# EAGLE design dabpi_v11 (EAGLE 6.6.0)
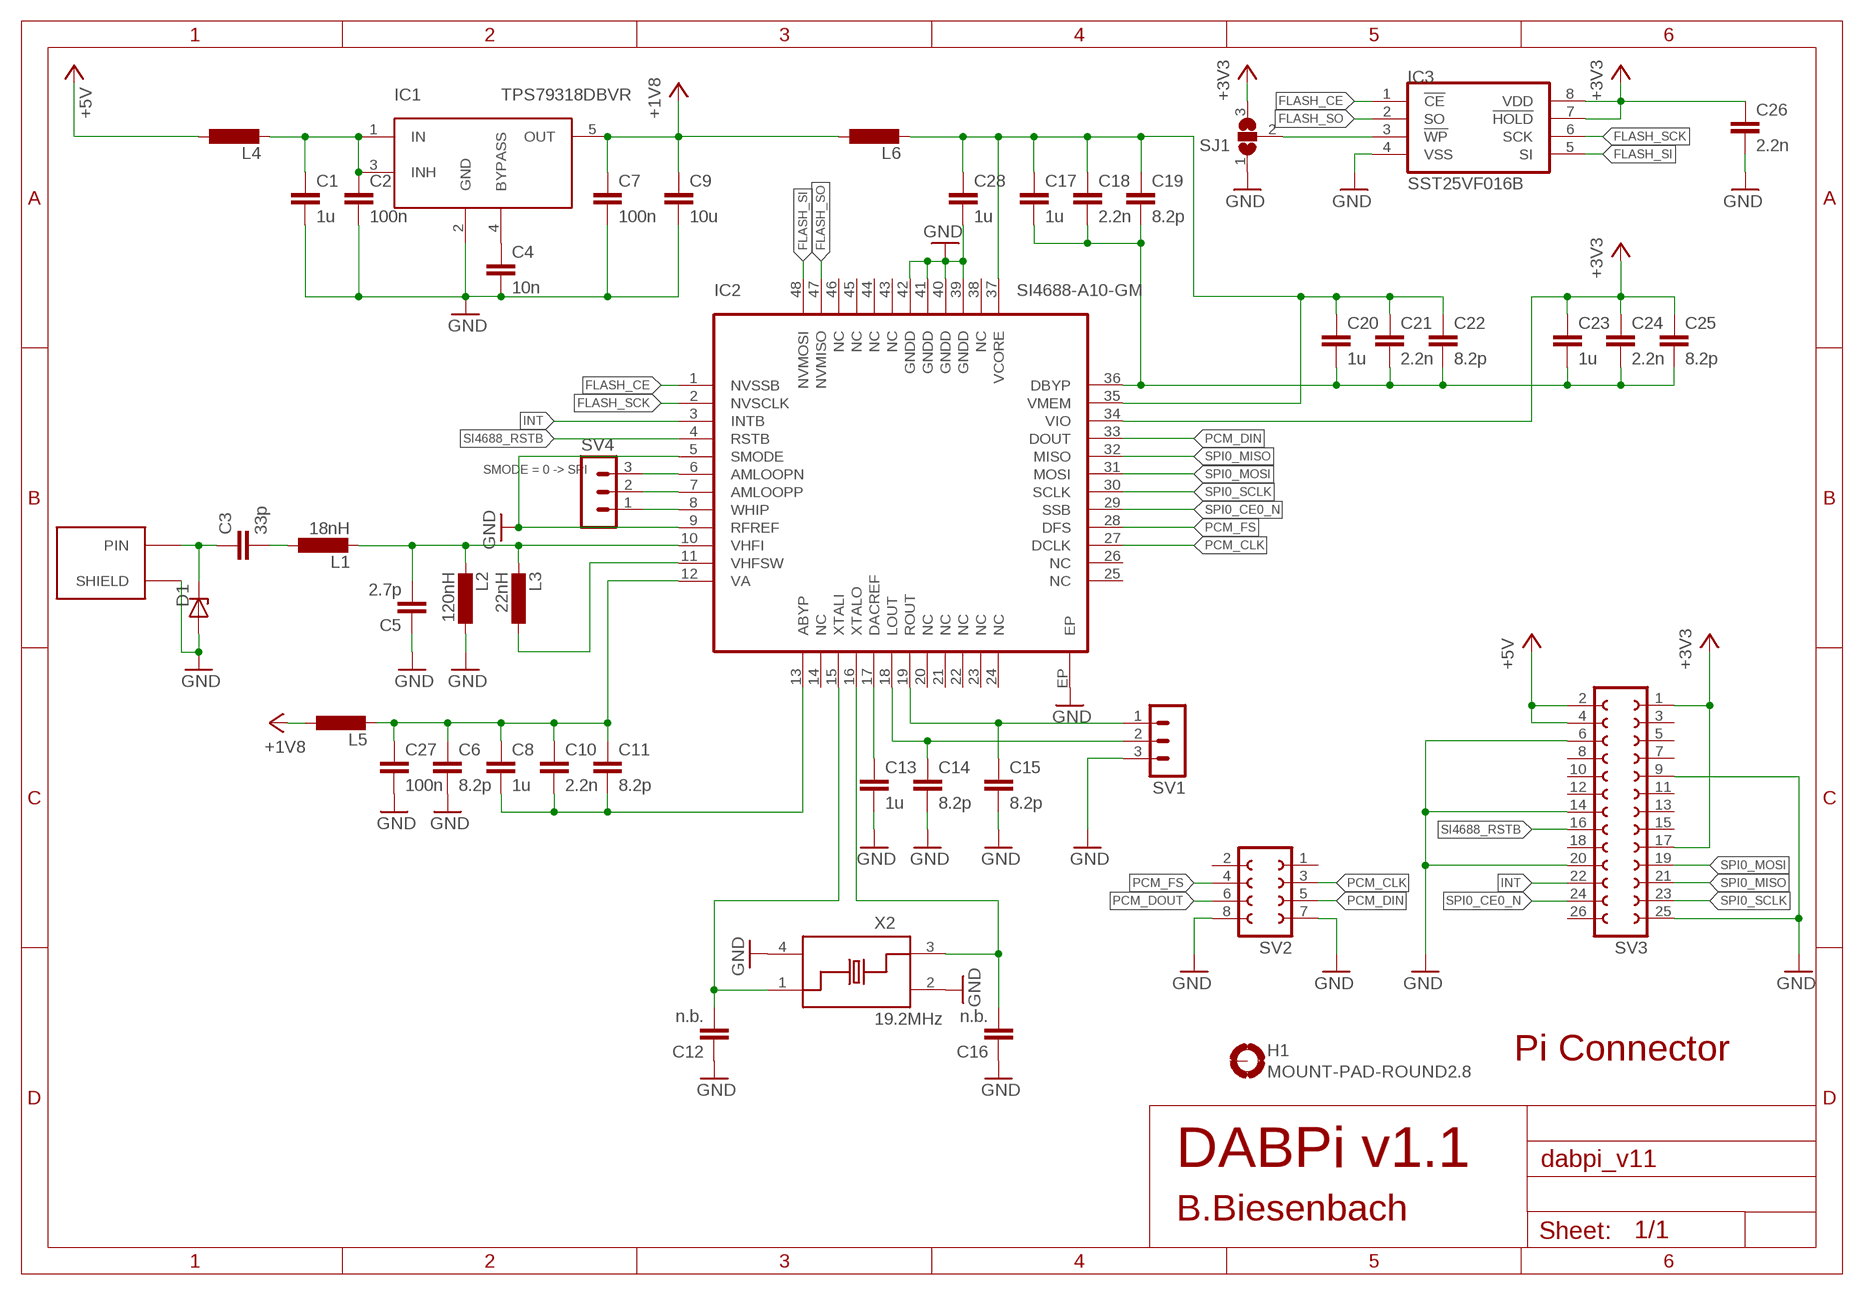
[diagram p0: schematic, sheet 1]

## Parts
C1  1u  C0603  [SMD0603]
C2  100n  C0603  [SMD0603]
C3  33p  C0402  [SMD0402]
C4  10n  C0603  [SMD0603]
C5  2.7p  C0402  [SMD0402]
C6  8.2p  C0603  [SMD0603]
C7  100n  C0603  [SMD0603]
C8  1u  C0603  [SMD0603]
C9  10u  C0603  [SMD0603]
C10  2.2n  C0603  [SMD0603]
C11  8.2p  C0603  [SMD0603]
C12  n.b.  C0402  [SMD0402]
C13  1u  C0603  [SMD0603]
C14  8.2p  C0603  [SMD0603]
C15  8.2p  C0603  [SMD0603]
C16  n.b.  C0402  [SMD0402]
C17  1u  C0603  [SMD0603]
C18  2.2n  C0603  [SMD0603]
C19  8.2p  C0603  [SMD0603]
C20  1u  C0603  [SMD0603]
C21  2.2n  C0603  [SMD0603]
C22  8.2p  C0603  [SMD0603]
C23  1u  C0603  [SMD0603]
C24  2.2n  C0603  [SMD0603]
C25  8.2p  C0603  [SMD0603]
C26  2.2n  C0603  [SMD0603]
C27  100n  C0603  [SMD0603]
C28  1u  C0603  [SMD0603]
D1  ESD9L5.0  [SOD923]
H1  MOUNT-PAD-ROUND2.8  [2,8-PAD]
IC1  TPS79318DBVR  [SOT23-5]
IC2  SI4688-A10-GM  [QFN48]
IC3  SST25VF016B  [SO08]
L1  18nH  L0402  [SMD0402]
L2  120nH  L0402  [SMD0402]
L3  22nH  L0402  [SMD0402]
L4  L0603  [SMD0603]
L5  L0603  [SMD0603]
L6  L0603  [SMD0603]
SJ1  SJ2W  [SJ_2]
SV1  MA03-1  [MA03-1]
SV2  FE04-2  [FE04-2]
SV3  FE13-2  [FE13-2]
SV4  MA03-1  [MA03-1]
X1  SMA_LP_1.57MM  [SMA_LP_1.57MM]
X2  19.2MHz  XTAL_3.2X2.5  [XTAL_3.2X2.5]

## Nets
+1V8: C7.1 C9.1 IC1.5(OUT) L5.1 L6.1
+3V3: C23.1 C24.1 C25.1 C26.1 IC2.34(VIO) IC3.7(!HOLD) IC3.8(VDD) SJ1.3 SV3.1 SV3.17
+5V: L4.1 SV3.2 SV3.4
FLASH_CE: IC2.1(NVSSB) IC3.1(!CE)
FLASH_SCK: IC2.2(NVSCLK) IC3.6(SCK)
FLASH_SI: IC2.48(NVMOSI) IC3.5(SI)
FLASH_SO: IC2.47(NVMISO) IC3.2(SO)
GND: C1.2 C2.2 C4.2 C5.1 C6.2 C7.2 C9.2 C12.1 C13.2 C14.2 C15.2 C16.1 C26.2 C27.2 C28.2 D1.A IC1.2(GND) IC2.5(SMODE) IC2.9(RFREF) IC2.39(GNDD) IC2.40(GNDD) IC2.41(GNDD) IC2.42(GNDD) IC2.EP IC3.4(VSS) L2.1 SJ1.1 SV1.3 SV2.7 SV2.8 SV3.6 SV3.9 SV3.14 SV3.20 SV3.25 X1.GND(SHIELD) X1.GND@1(SHIELD) X1.GND@2(SHIELD) X1.GND@3(SHIELD) X2.2(GND) X2.4(GND)
INT: IC2.3(INTB) SV3.22
LDO_IN: C1.1 C2.1 IC1.1(IN) IC1.3(INH) L4.2
N$1: C3.2 L1.1
N$2: C5.2 IC2.10(VHFI) L1.2 L2.2 L3.2
N$3: IC2.11(VHFSW) L3.1
N$4: C8.2 C10.2 C11.2 IC2.13(ABYP)
N$5: C17.2 C18.2 C19.2 C20.2 C21.2 C22.2 C23.2 C24.2 C25.2 IC2.36(DBYP)
N$6: C12.2 IC2.15(XTALI) X2.1
N$7: C16.2 IC2.16(XTALO) X2.3
N$8: C13.1 IC2.17(DACREF)
N$9: IC3.3(!WP) SJ1.2
N$11: C4.1 IC1.4(BYPASS)
N$12: C6.1 C8.1 C10.1 C11.1 C27.1 IC2.12(VA) L5.2
N$13: IC2.6(AMLOOPN) SV4.3
N$14: C17.1 C18.1 C19.1 C20.1 C21.1 C22.1 C28.1 IC2.35(VMEM) IC2.37(VCORE) L6.2
N$15: IC2.7(AMLOOPP) SV4.2
N$16: IC2.8(WHIP) SV4.1
PCM_CLK: IC2.27(DCLK) SV2.3
PCM_DIN: IC2.33(DOUT) SV2.5
PCM_DOUT: SV2.6
PCM_FS: IC2.28(DFS) SV2.4
RF_IN: C3.1 D1.K(C) X1.PIN
SI4688_LOUT: C14.1 IC2.18(LOUT) SV1.2
SI4688_ROUT: C15.1 IC2.19(ROUT) SV1.1
SI4688_RSTB: IC2.4(RSTB) SV3.16
SPI0_CE0_N: IC2.29(SSB) SV3.24
SPI0_MISO: IC2.32(MISO) SV3.21
SPI0_MOSI: IC2.31(MOSI) SV3.19
SPI0_SCLK: IC2.30(SCLK) SV3.23
Unconnected: H1.B2,8(MOUNT) IC2.14(NC) IC2.20(NC) IC2.21(NC) IC2.22(NC) IC2.23(NC) IC2.24(NC) IC2.25(NC) IC2.26(NC) IC2.38(NC) IC2.43(NC) IC2.44(NC) IC2.45(NC) IC2.46(NC) SV2.1 SV2.2 SV3.3 SV3.5 SV3.7 SV3.8 SV3.10 SV3.11 SV3.12 SV3.13 SV3.15 SV3.18 SV3.26

## Notes on the sheet
- SMODE = 0 -> SPI
- Pi Connector
- DABPi v1.1
- B.Biesenbach

## Library data of the parts
C1 C2 C4 C6-C11 C13-C15 C17-C28 = generisch:C0603
C3 C5 C12 C16 = generisch:C0402
D1 = generisch:ESD9L5.0
H1 = holes:MOUNT-PAD-ROUND: MOUNTING PAD, round
IC1 = ldo_reg:TPS79318DBVR
IC2 = SI4688-A10-GM:SI4688-A10-GM
IC3 = sst25:SST25VF016B
L1-L3 = generisch:L0402
L4-L6 = generisch:L0603
SJ1 = jumper:SJ2W: SMD solder JUMPER
SV1 SV4 = con-lstb:MA03-1: PIN HEADER; OC_FARNELL: unknown; OC_NEWARK: unknown
SV2 = generisch:FE04-2: FEMALE HEADER; OC_FARNELL: unknown; OC_NEWARK: unknown
SV3 = con-lsta:FE13-2: FEMALE HEADER; OC_FARNELL: unknown; OC_NEWARK: unknown
X1 = con_sma:SMA_LP_1.57MM: Abschlussbuchse SMA LP rund 1,57mm RS 526-5785
X2 = generisch:XTAL_3.2X2.5

## Board
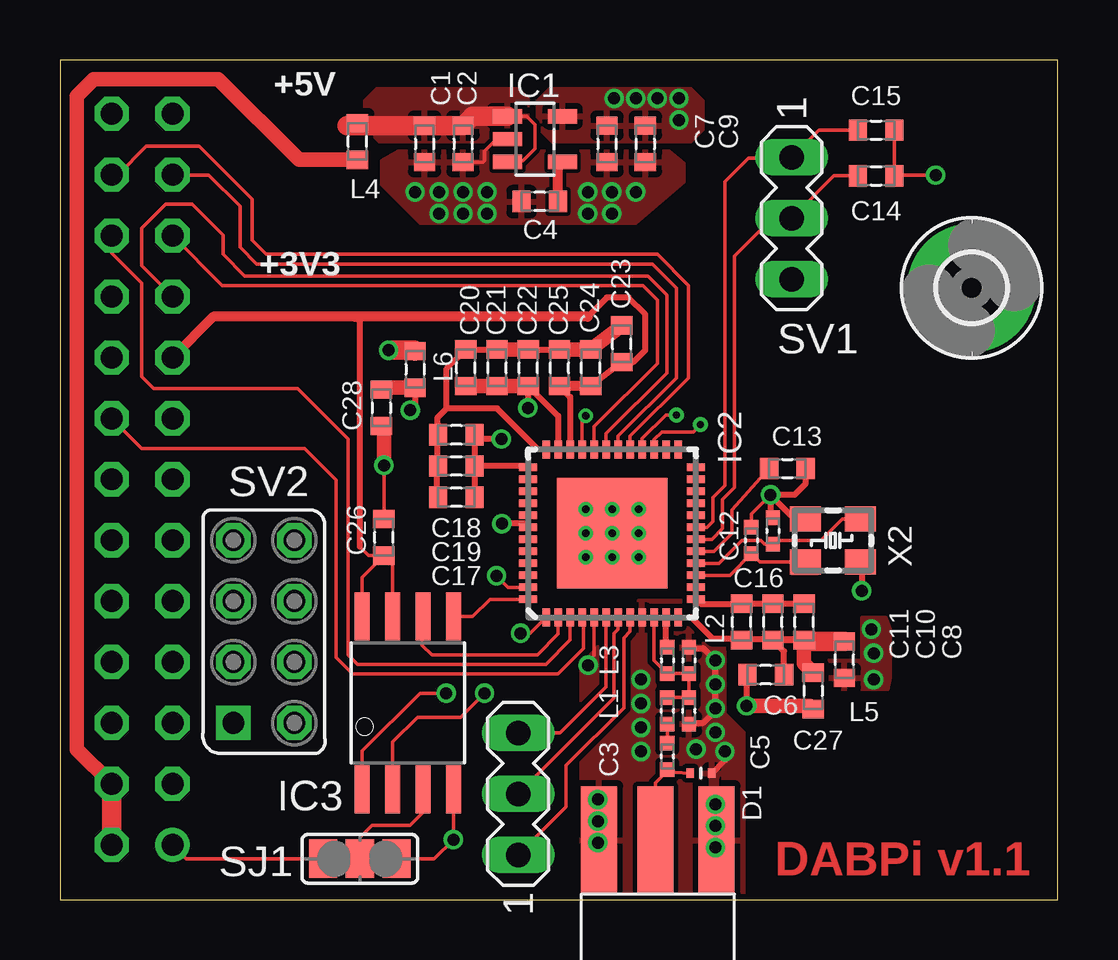
[diagram p1: board, top side]
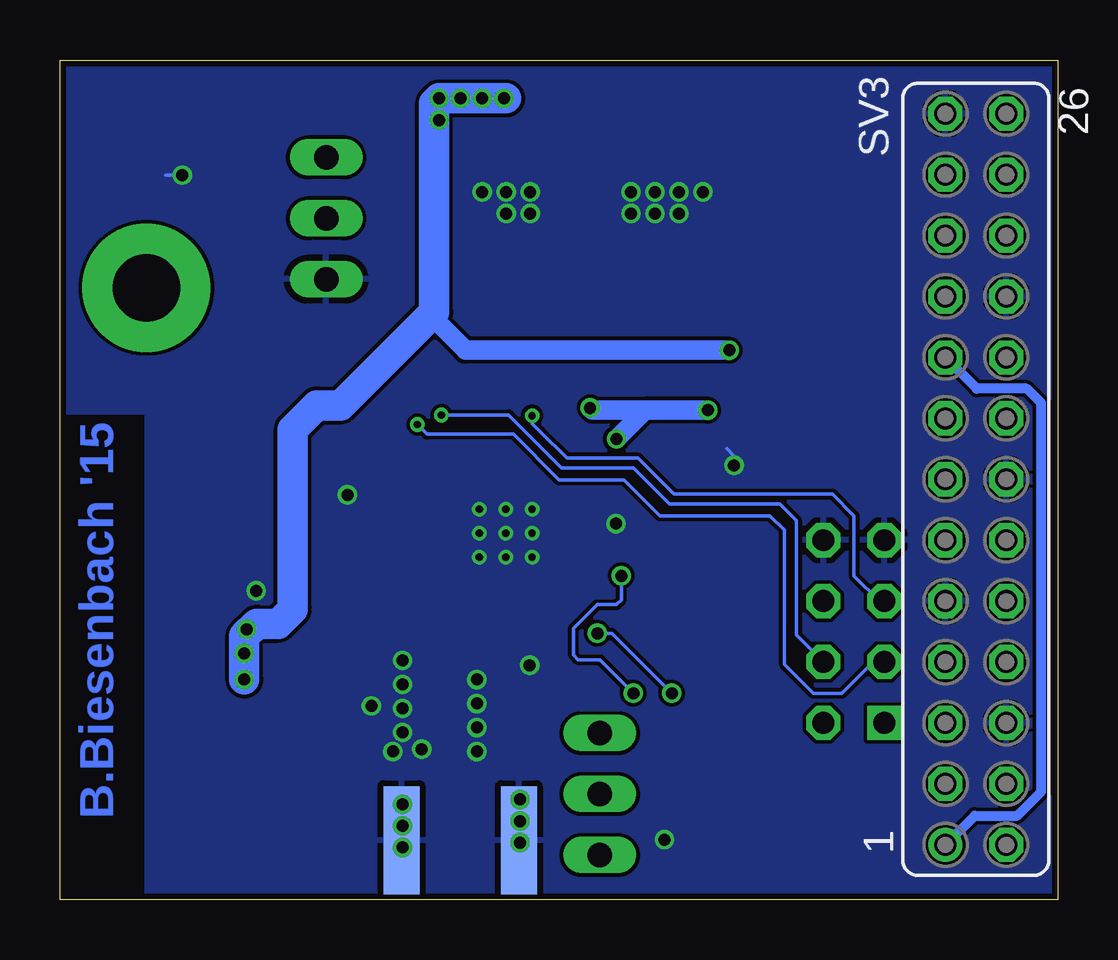
[diagram p2: board, bottom side, seen from below]

Size 41.6 x 35 mm. Coordinates in mm from the lower left corner, seen from the top.
Outline: 0,0 41.6,0 41.6,35 0,35 0,0
Copper layers (1*16): Top 0.035mm / dielectric 1.5mm / Bottom 0.035mm
Design rules "Elecrow_2-layer_eagle_rule *": minimum track width 6mil, minimum drill 12mil, track to track 6mil, track to pad 6mil, pad to pad 6mil, via to via 6mil, smd to smd 0mil, copper to edge 10mil, drill to drill 10mil, minimum pad ring 10mil, minimum via ring 6mil, stop-mask expansion 2mil, vias tented up to drill 0mil, thermal gap 10mil
tKeepout: area 29.1,0 to 41.6,3.1
bRestrict: area 38.1,0 to 41.6,20.2

### Footprints (pad centres in the part's own frame; a part is rotated, then mirrored left to right if it is on the bottom)
SMD0603 = smd 0.762 x 0.889: 1 -0.762,0; 2 0.762,0
SMD0402 = smd 0.6 x 0.6: 1 -0.55,0; 2 0.55,0
SOD923 = smd 0.3 x 0.4: A -0.45,0; K 0.45,0
2,8-PAD = drill 2.8 pad 5.334: B2,8 0,0
SOT23-5 = smd 0.6 x 1.2: 1 -0.95,-1.15; 2 0,-1.15; 3 0.95,-1.15; 4 0.95,1.15; 5 -0.95,1.15
QFN48 = smd 0.75 x 0.3: 1 -3.5,2.75; 2 -3.5,2.25; 3 -3.5,1.75; 4 -3.5,1.25; 5 -3.5,0.75; 6 -3.5,0.25; 7 -3.5,-0.25; 8 -3.5,-0.75; 9 -3.5,-1.25; 10 -3.5,-1.75; 11 -3.5,-2.25; 12 -3.5,-2.75; 25 3.5,-2.75; 26 3.5,-2.25; 27 3.5,-1.75; 28 3.5,-1.25; 29 3.5,-0.75; 30 3.5,-0.25; 31 3.5,0.25; 32 3.5,0.75; 33 3.5,1.25; 34 3.5,1.75; 35 3.5,2.25; 36 3.5,2.75 | smd 0.3 x 0.75: 13 -2.75,-3.5; 14 -2.25,-3.5; 15 -1.75,-3.5; 16 -1.25,-3.5; 17 -0.75,-3.5; 18 -0.25,-3.5; 19 0.25,-3.5; 20 0.75,-3.5; 21 1.25,-3.5; 22 1.75,-3.5; 23 2.25,-3.5; 24 2.75,-3.5; 37 2.75,3.5; 38 2.25,3.5; 39 1.75,3.5; 40 1.25,3.5; 41 0.75,3.5; 42 0.25,3.5; 43 -0.25,3.5; 44 -0.75,3.5; 45 -1.25,3.5; 46 -1.75,3.5; 47 -2.25,3.5; 48 -2.75,3.5 | smd 4.6 x 4.6: EP 0,0
SO08 = smd 0.61 x 2: 1 -1.905,-3.6; 2 -0.635,-3.6; 3 0.635,-3.6; 4 1.905,-3.6; 5 1.905,3.6; 6 0.635,3.6; 7 -0.635,3.6; 8 -1.905,3.6
SJ_2 = smd 1.168 x 1.6: 1 -1.524,0; 2 0,0; 3 1.524,0
MA03-1 = drill 1.016 long: 1 -2.54,0; 2 0,0; 3 2.54,0
FE04-2 = drill 0.914 square: 1 -3.81,1.27 | drill 0.914 octagon: 2 -3.81,-1.27; 3 -1.27,1.27; 4 -1.27,-1.27; 5 1.27,1.27; 6 1.27,-1.27; 7 3.81,1.27; 8 3.81,-1.27
FE13-2 = drill 0.914: 1 -15.24,1.27 | drill 0.914 octagon: 2 -15.24,-1.27; 3 -12.7,1.27; 4 -12.7,-1.27; 5 -10.16,1.27; 6 -10.16,-1.27; 7 -7.62,1.27; 8 -7.62,-1.27; 9 -5.08,1.27; 10 -5.08,-1.27; 11 -2.54,1.27; 12 -2.54,-1.27; 13 0,1.27; 14 0,-1.27; 15 2.54,1.27; 16 2.54,-1.27; 17 5.08,1.27; 18 5.08,-1.27; 19 7.62,1.27; 20 7.62,-1.27; 21 10.16,1.27; 22 10.16,-1.27; 23 12.7,1.27; 24 12.7,-1.27; 25 15.24,1.27; 26 15.24,-1.27
SMA_LP_1.57MM = smd 4.5 x 1.5: GND 7,2.45; GND@2 7,-2.45; PIN 7,0.1 | smd 4.5 x 1.5 bottom: GND@1 7,-2.45; GND@3 7,2.45
XTAL_3.2X2.5 = smd 1.3 x 1.05: 1 -1.15,-0.9; 2 1.15,-0.9; 3 1.15,0.9; 4 -1.15,0.9

### Placement (x,y rotation side)
C1  15.2,31.5 270 top
C2  16.8,31.5 270 top
C3  25.32,5.97 90 top
C4  20,29.1 180 top
C5  26.22,7.87 90 top
C6  29.42,9.37 180 top
C7  22.8,31.5 270 top
C8  31.02,11.57 90 top
C9  24.4,31.5 270 top
C10  29.72,11.57 90 top
C11  28.42,11.57 90 top
C12  28.82,14.97 270 top
C13  30.32,17.97 0 top
C14  34.02,30.17 0 top
C15  34.02,32.07 0 top
C16  29.72,15.37 270 top
C17  16.52,16.77 180 top
C18  16.52,19.37 180 top
C19  16.52,18.07 180 top
C20  16.92,22.17 90 top
C21  18.22,22.17 90 top
C22  19.52,22.17 90 top
C23  23.42,23.17 90 top
C24  22.12,22.17 90 top
C25  20.82,22.17 90 top
C26  13.5,15.1 90 top
C27  31.4,8.7 270 top
C28  13.4,20.5 270 top
D1  26.72,5.27 180 top
H1  38,25.5 0 top
IC1  19.8,31.7 270 top
IC2  23.02,15.27 90 top
IC3  14.5,8.2 0 top
L1  25.32,7.87 90 top
L2  26.22,9.97 270 top
L3  25.32,9.97 270 top
L4  12.4,31.6 90 top
L5  32.7,10 90 top
L6  14.8,22.1 270 top
SJ1  12.5,1.7 180 top
SV1  30.5,28.4 270 top
SV2  8.5,11.17 90 top
SV3  3.42,17.52 90 bottom
SV4  19.1,4.4 90 top
X1  24.92,-4.53 90 top
X2  32.22,14.97 0 top

### Tracks (layer width: path | path; a pad name or v marks a point on that pad's centre or on a via)
+1V8  (via drill 0.5)
  Top 0.813: L6.1 14.76,22.9 v13.7,22.9
  Bottom 0.813: v13.7,22.9 24.7,22.9 26.2,24.4 26.2,24.3 26.45,24.05
  Bottom 1.27: v33.92,9.17 33.92,10.98 33.4,11.5 32.5,11.5 31.9,12.1 31.9,19.6 30.9,20.6 29.9,20.6 26.45,24.05 26,24.5 26,33.2 v25.8,33.4 23,33.4
  other vias: 33.82,11.27 23.1,33.4 24,33.4 24.9,33.4 25.8,32.5 33.92,10.27
  pour Top (isolate 0.2): 34.62,11.27 34.62,9.27 34.52,8.77 31.82,8.77 31.82,9.97 33.42,9.97 33.42,11.77 34.42,11.77
  pour Top: 20.5,31.6 26.3,31.6 26.8,32.1 26.8,33.3 26.3,33.8 20.4,33.8 19.9,33.3 19.9,32.2
+3V3
  Top 0.152: C26.1 13.39,14.23 | C26.1 12.86,14.34 12.5,14.7 | SJ1.3 5.27,1.7 SV3.1 | IC3.7 13.87,13.97 C26.1 | IC3.8 12.6,13.43 C26.1
  Top 0.254: C24.1 C23.1 23.91,22.41 24.4,22.9 24.4,24.4 23.7,25.1 22.8,25.1 22,24.3 | C25.1 21.27,20.96 IC2.34 | 12.5,14.7 12.5,24.1 12.3,24.3 | 13.5,14.3 C26.1
  Top 0.406: C24.1 C25.1 | C23.1 23.56,22.41 | 22,24.3 12.3,24.3 6.39,24.3 SV3.17
  Bottom 0.406: SV3.1 3.47,3.5 1.7,3.5 0.7,4.5 0.7,20.7 1.3,21.3 3.39,21.3 SV3.17
+5V
  Top 0.61: SV3.4 0.7,6.27 0.7,33.5 1.4,34.2 6.6,34.2 9.96,30.84 L4.1
  Top 0.813: SV3.2 SV3.4
FLASH_CE  (via drill 0.5)
  Top 0.152: v19.2,11.1 19.6,11.1 IC2.1 | IC3.1 12.6,6.2 15,8.6 v16.1,8.6
  Bottom 0.152: 19.3,11 v19.2,11.1 18.6,11.1 v16.1,8.6
FLASH_SCK
  Top 0.152: IC2.2 20.77,11.07 19.9,10.2 15.5,10.2 15.1,10.6 15.1,11.77 IC3.6
FLASH_SI
  Top 0.152: IC2.48 17.93,12.52 17.2,11.8 IC3.5
FLASH_SO  (via drill 0.5)
  Top 0.152: v18.2,13.5 18.68,13.02 IC2.47 | IC3.2 13.87,6.57 14.9,7.6 16.7,7.6 v17.7,8.6
  Bottom 0.152: v17.7,8.6 19.1,10 20,10 20.2,10.2 20.2,11.3 19.2,12.3 18.4,12.3 18.2,12.5 v18.2,13.5
GND  (via drill 0.3, 0.3 pad 0.3, 0.5)
  Top 0.152: C16.1 29.77,15.87 | 23.12,17.07 IC2.EP | C12.1 28.82,16.07 v29.62,16.87 | IC1.2 18.2,31.7 17.7,31.2 17.7,30.8 17.64,30.74 C2.2 | C15.2 C14.2 34.81,30.2 v36.5,30.2 | v13.5,18.1 C26.2 13.56,15.8 | IC2.5 22.27,10.17 | SJ1.1 15.6,1.7 v16.4,2.5 IC3.4 16.5,4.5
  Top 0.254: IC2.39 IC2.40 IC2.41 IC2.42 19.37,15.67 v18.42,15.67 | L2.1 26.27,10.47 26.82,10.47 v27.32,9.97 27.32,7.87 26.82,7.37 26.27,7.37 C5.1 | D1.A 27.72,5.82 v27.72,6.17 | C6.2 28.62,9.33 v28.62,8.07 | X2.2 33.42,14.02 v33.42,12.87 | IC2.EP 23.02,16.97 23.12,17.07 | v22.42,2.37 v22.42,3.27 22.42,2.52 X1.GND 22.47,4.12 v22.42,4.17 | X1.GND@2 27.37,3.02 v27.32,3.07 27.32,1.27 27.37,1.32 X1.GND@2 | X1.GND@2 27.37,3.92 v27.32,3.97 | v29.62,16.87 29.62,15.92 C16.1 | C13.2 31.08,17.33 30.62,16.87 v29.62,16.87 | X2.4 30.62,15.87 v29.62,16.87
  Top 0.61: C27.2 31.27,8.07 v28.62,8.07 | C28.2 13.5,19.64 v13.5,18.1
  Bottom 0.152: v36.5,30.2 37.2,30.2 | v13.5,18.1 13.5,18.5 13.8,18.8 | 22.29,4.3 v22.42,4.17
  other vias: 24.12,15.27 24.12,16.27 24.12,14.27 23.02,16.27 23.02,14.27 21.92,15.27 21.92,16.27 23.02,15.27 27.32,2.17 24.22,6.17 24.22,7.17 24.22,8.17 24.22,9.17 26.52,6.27 27.32,8.97 27.32,7.97 27.32,6.97 21.92,14.27 14.8,29.5 15.8,29.5 16.8,29.5 17.8,29.5 17.8,28.6 16.8,28.6 15.8,28.6 22,29.5 23,29.5 24,29.5 22,28.6 23,28.6 22.02,9.77
  pour Top (isolate 0.2): 21.72,0.27 21.72,9.77 24.12,12.47 26.22,12.47 27.72,10.97 27.72,7.77 28.52,6.97 28.52,0.27
  pour Bottom (rank 2): 0,0 41.6,0 41.6,35 0,35
  pour Top: 13.4,30.8 13.4,29.8 15,28.2 24,28.2 26,29.9 26,30.7 25.4,31.2 14.1,31.2
INT
  Top 0.152: IC2.3 21.27,10.82 20.25,9.8 12.4,9.8 12,10.2 12,19.2 9.9,21.3 3.9,21.3 3.4,21.8 3.4,25.7 2.15,26.95 SV3.22
LDO_IN
  Top 0.152: IC1.1 19.45,32.65 19.8,32.3 19.8,31.3 19.3,30.8 18.7,30.8 IC1.3
  Top 0.813: 11.96,32.26 C2.1 17.19,32.65 IC1.1
  pour Top: 13.3,31.6 19.1,31.6 19.5,32 19.5,33.4 19.1,33.8 13.2,33.8 12.7,33.3 12.7,32.2
N$1
  Top 0.152: L1.1 C3.2
N$2
  Top 0.152: IC2.10 24.77,9.97 L3.2 L2.2 C5.2 L1.2
N$3
  Top 0.254: L3.1 25.27,10.57 IC2.11
N$4
  Top 0.254: IC2.13 26.71,12.33 C11.2 C10.2 C8.2
N$5
  Top 0.254: IC2.36 19.92,18.77 18.22,20.47 16.12,20.47 | 16.12,20.47 15.72,20.07 15.72,19.87 | 15.72,19.87 15.72,18.03 | C17.2 15.72,16.81 15.72,18.03 | 16.12,20.47 16.12,22.13 C20.2 C21.2 | C22.2 C25.2 | 15.72,18.03 C19.2 | C18.2 15.76,19.83 15.72,19.87
  Top 0.61: C23.2 C24.2 C25.2 | C22.2 C21.2
N$6
  Top 0.152: X2.1 29.17,14.07 C12.2 27.92,13.52 IC2.15
N$7
  Top 0.152: IC2.16 27.47,14.02 28.42,14.97 29.22,14.97 29.37,14.82 C16.2 29.87,14.97 31.72,14.97 32.62,15.87 X2.3
N$8
  Top 0.152: IC2.17 27.27,14.52 28.02,15.27 28.02,16.23 C13.1
N$9
  Top 0.152: IC3.3 15.13,3.63 14.6,3.1 13,3.1 12.5,2.6 SJ1.2
N$11
  Top 0.406: C4.1 20.76,30.56 IC1.4
N$12
  Top 0.254: IC2.12 26.32,11.77 27.22,10.87 28.36,10.87 | 28.36,10.87 30.96,10.87 | 30.96,10.87 C8.1 | C6.1 30.18,10.35 C10.1 30.9,10.81 30.96,10.87 | C11.1 28.36,10.87
  Top 0.61: C27.1 31.02,9.84 C8.1
  Top 0.813: L5.2 31.07,10.76 C8.1
N$13
  Top 0.152: IC2.6 22.77,8.87 20.84,6.94 SV4.3
N$14  (via drill 0.5)
  Top 0.254: IC2.35 20.77,20.16 C22.1 19.52,20.52 v19.5,20.5 | C19.1 C18.1 17.45,19.2 v18.4,19.2 | C19.1 C17.1 | IC2.37 19.47,18.07 C19.1 | L6.2 14.8,20.6 v14.6,20.4
  Top 0.406: 18.58,21.41 C21.1
  Top 0.61: C20.1 C21.1 C22.1 | C28.1 13.48,21.34 L6.2
  Bottom 0.813: v14.6,20.4 17.2,20.4 | 17.2,20.4 v18.4,19.2 | v19.5,20.5 19.4,20.4 17.2,20.4
N$15
  Top 0.152: 19.4,4.4 SV4.2 23.1,8.4 23.1,11.1 23.27,11.27 IC2.7
N$16
  Top 0.152: IC2.8 23.77,11.17 23.5,10.9 23.5,8 21.1,5.6 21.1,3.86 SV4.1
PCM_CLK  (via drill 0.3)
  Top 0.152: v26.7,19.8 26.4,19.5 25.1,19.5 24.77,19.17 IC2.27
  Bottom 0.152: SV2.3 7.7,9.9 9,8.6 10.2,8.6 11.4,9.8 11.4,15.4 12,16 16.6,16 18.1,17.5 20.8,17.5 22.7,19.4 26.3,19.4 v26.7,19.8
PCM_DIN  (via drill 0.3)
  Top 0.152: IC2.33 21.77,20.02 v21.92,20.17
  Bottom 0.152: SV2.5 7.44,12.44 8.5,13.5 8.5,16 9.4,16.9 16,16.9 17.5,18.4 20.47,18.4 21.59,19.52 21.77,19.7 21.92,19.85 v21.92,20.17
PCM_FS  (via drill 0.3)
  Top 0.152: v25.7,20.2 25.25,20.2 24.27,19.22 IC2.28
  Bottom 0.152: v25.7,20.2 22.9,20.2 20.7,18 17.7,18 16.2,16.5 11.6,16.5 10.9,15.8 10.9,11.03 SV2.4
RF_IN
  Top 0.152: D1.K 25.32,5.32 C3.1 25.32,5.37 24.82,4.87 X1.PIN
SI4688_LOUT
  Top 0.152: IC2.18 27.17,15.02 27.62,15.47 27.62,16.67 28.12,17.17 28.12,26.82 29.7,28.4 SV1.2 32.27,30.17 C14.1
SI4688_ROUT
  Top 0.152: IC2.19 26.97,15.52 27.22,15.77 27.22,16.77 27.72,17.27 27.72,29.92 28.7,30.9 29.66,30.9 SV1.1 31.63,32.07 C15.1
SI4688_RSTB
  Top 0.152: IC2.4 21.82,11.72 21.82,10.47 20.75,9.4 12.2,9.4 11.5,10.1 11.5,17.5 10.2,18.8 3.4,18.8 SV3.16
SPI0_CE0_N
  Top 0.152: IC2.29 23.77,19.32 26.2,21.75 26.2,25.6 24.9,26.9 8.6,26.9 8,27.5 8,29.2 5.8,31.4 3.6,31.4 2.42,30.22 SV3.24
SPI0_MISO
  Top 0.152: IC2.32 22.27,19.72 24.9,22.35 24.9,25 24.3,25.6 6.77,25.6 SV3.21
SPI0_MOSI
  Top 0.152: IC2.31 22.77,19.42 25.3,21.95 25.3,25.2 24.5,26 7.7,26 6.8,26.9 6.8,27.7 5.5,29 4.4,29 3.4,28 3.4,26.43 SV3.19
SPI0_SCLK
  Top 0.152: IC2.30 23.27,19.32 25.7,21.75 25.7,25.5 24.7,26.5 8.2,26.5 7.5,27.2 7.5,28.9 6.2,30.2 4.71,30.2 SV3.23

### Text on the board
Top: DABPi v1.1
Bottom: B.Biesenbach '15
tPlace: +5V | +3V3